# EAGLE schematic Schematic (EAGLE 9.7.0)
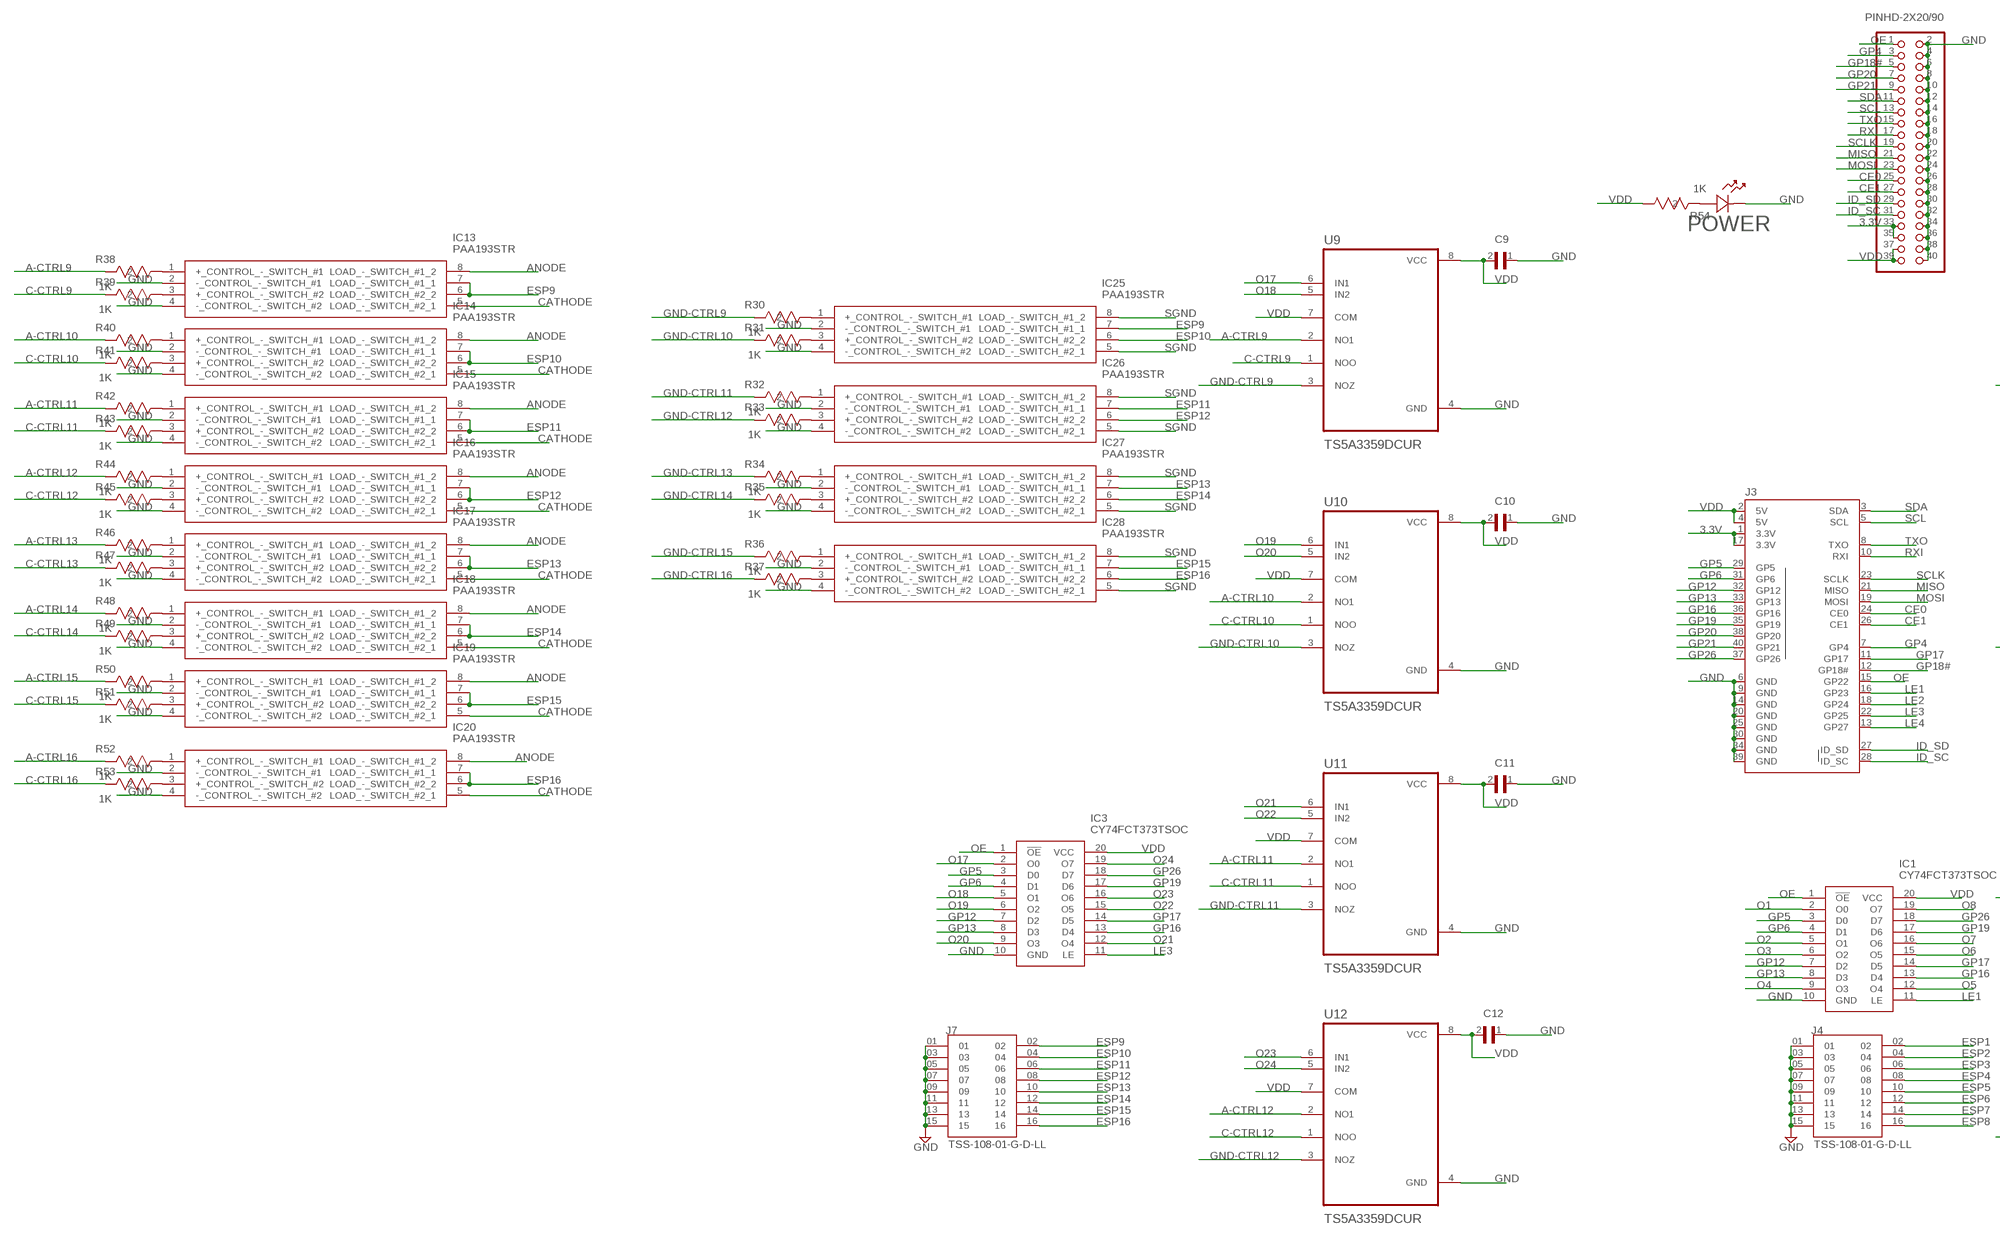
[diagram p0: schematic, sheet 1, part 1 of 3]
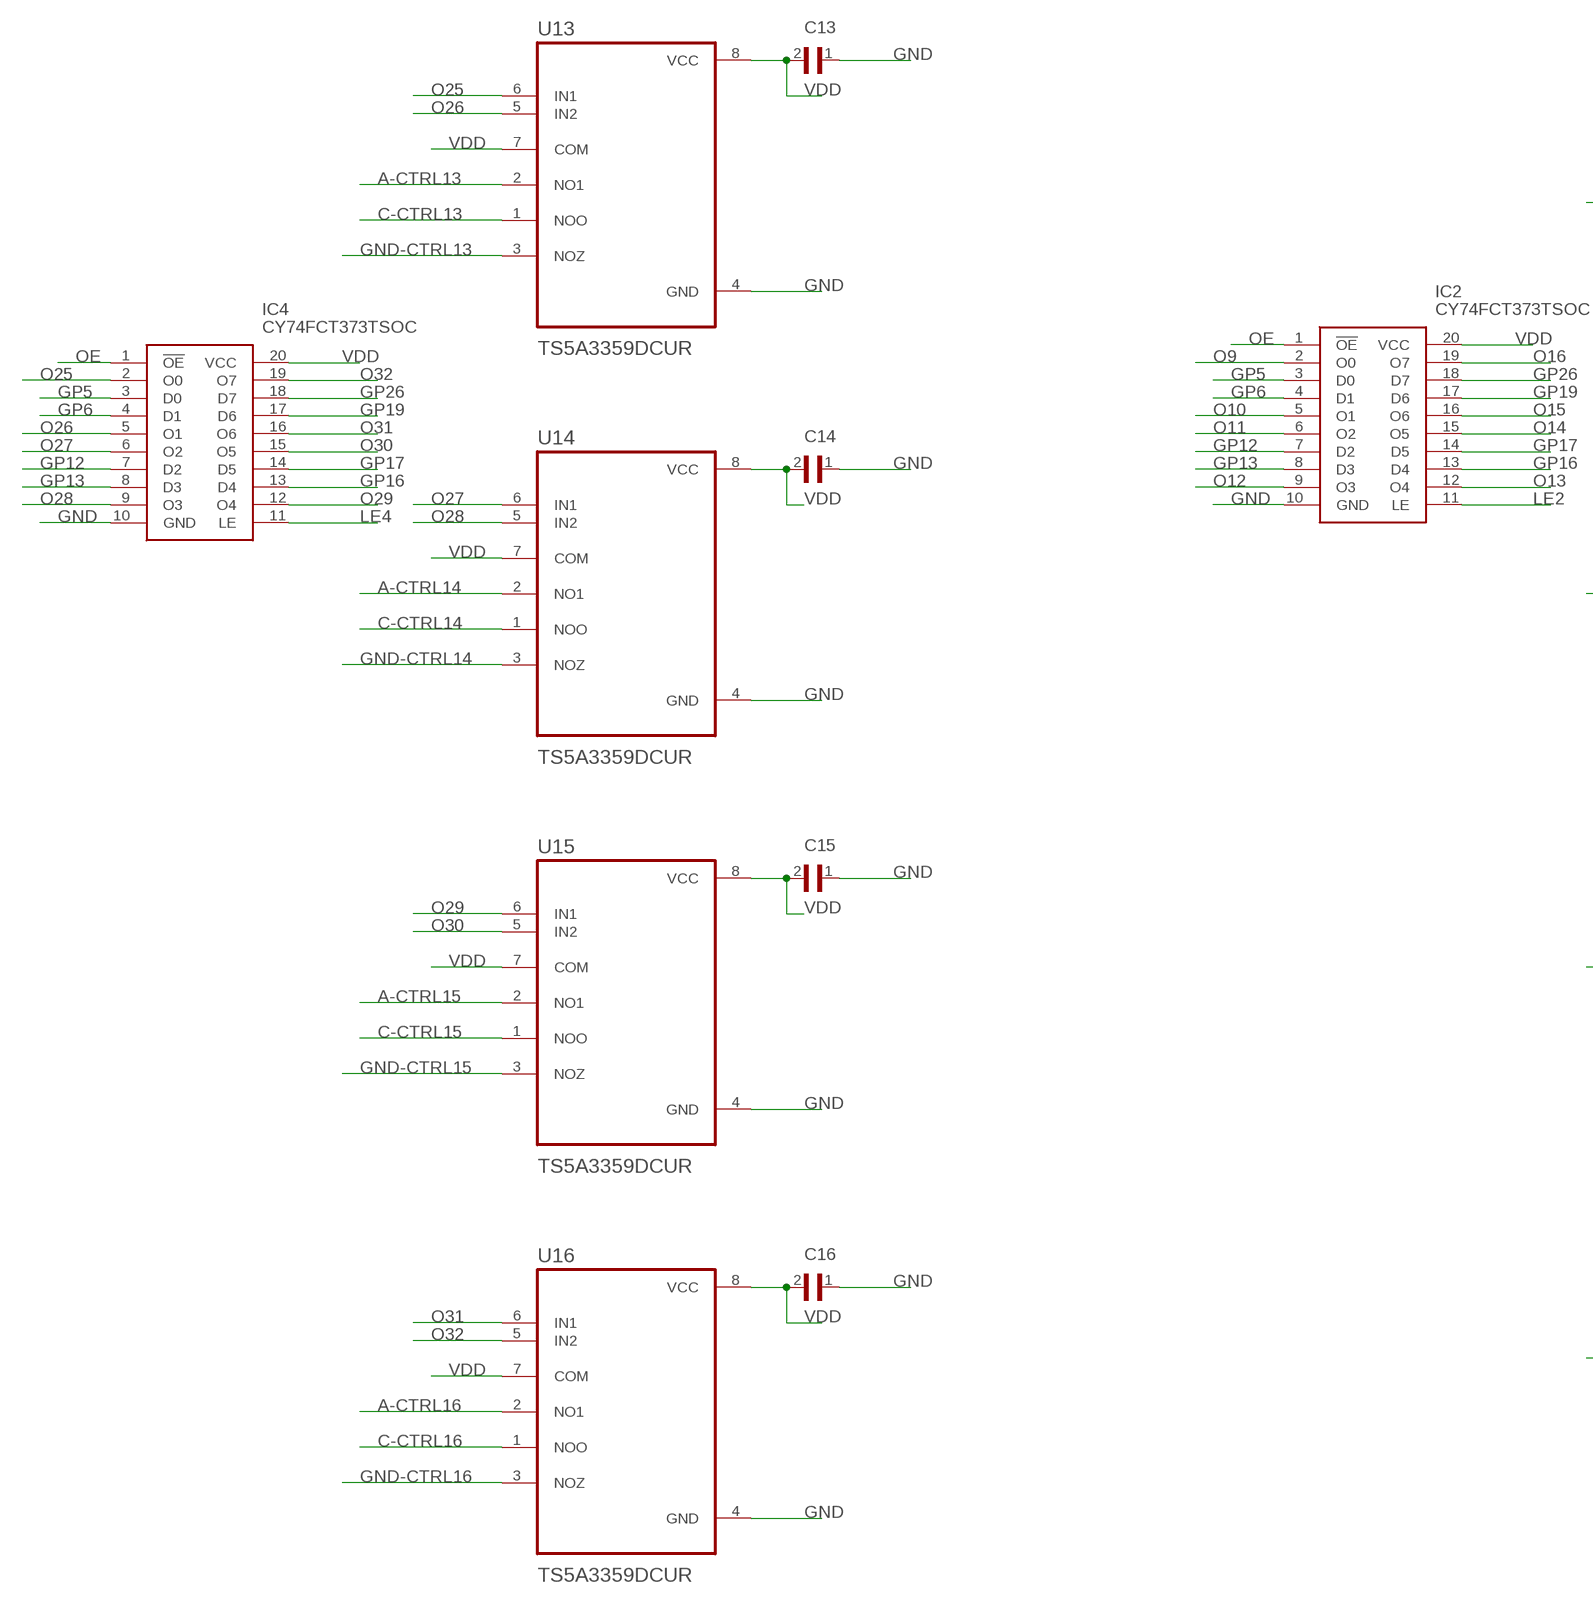
[diagram p1: schematic, sheet 1, part 2 of 3]
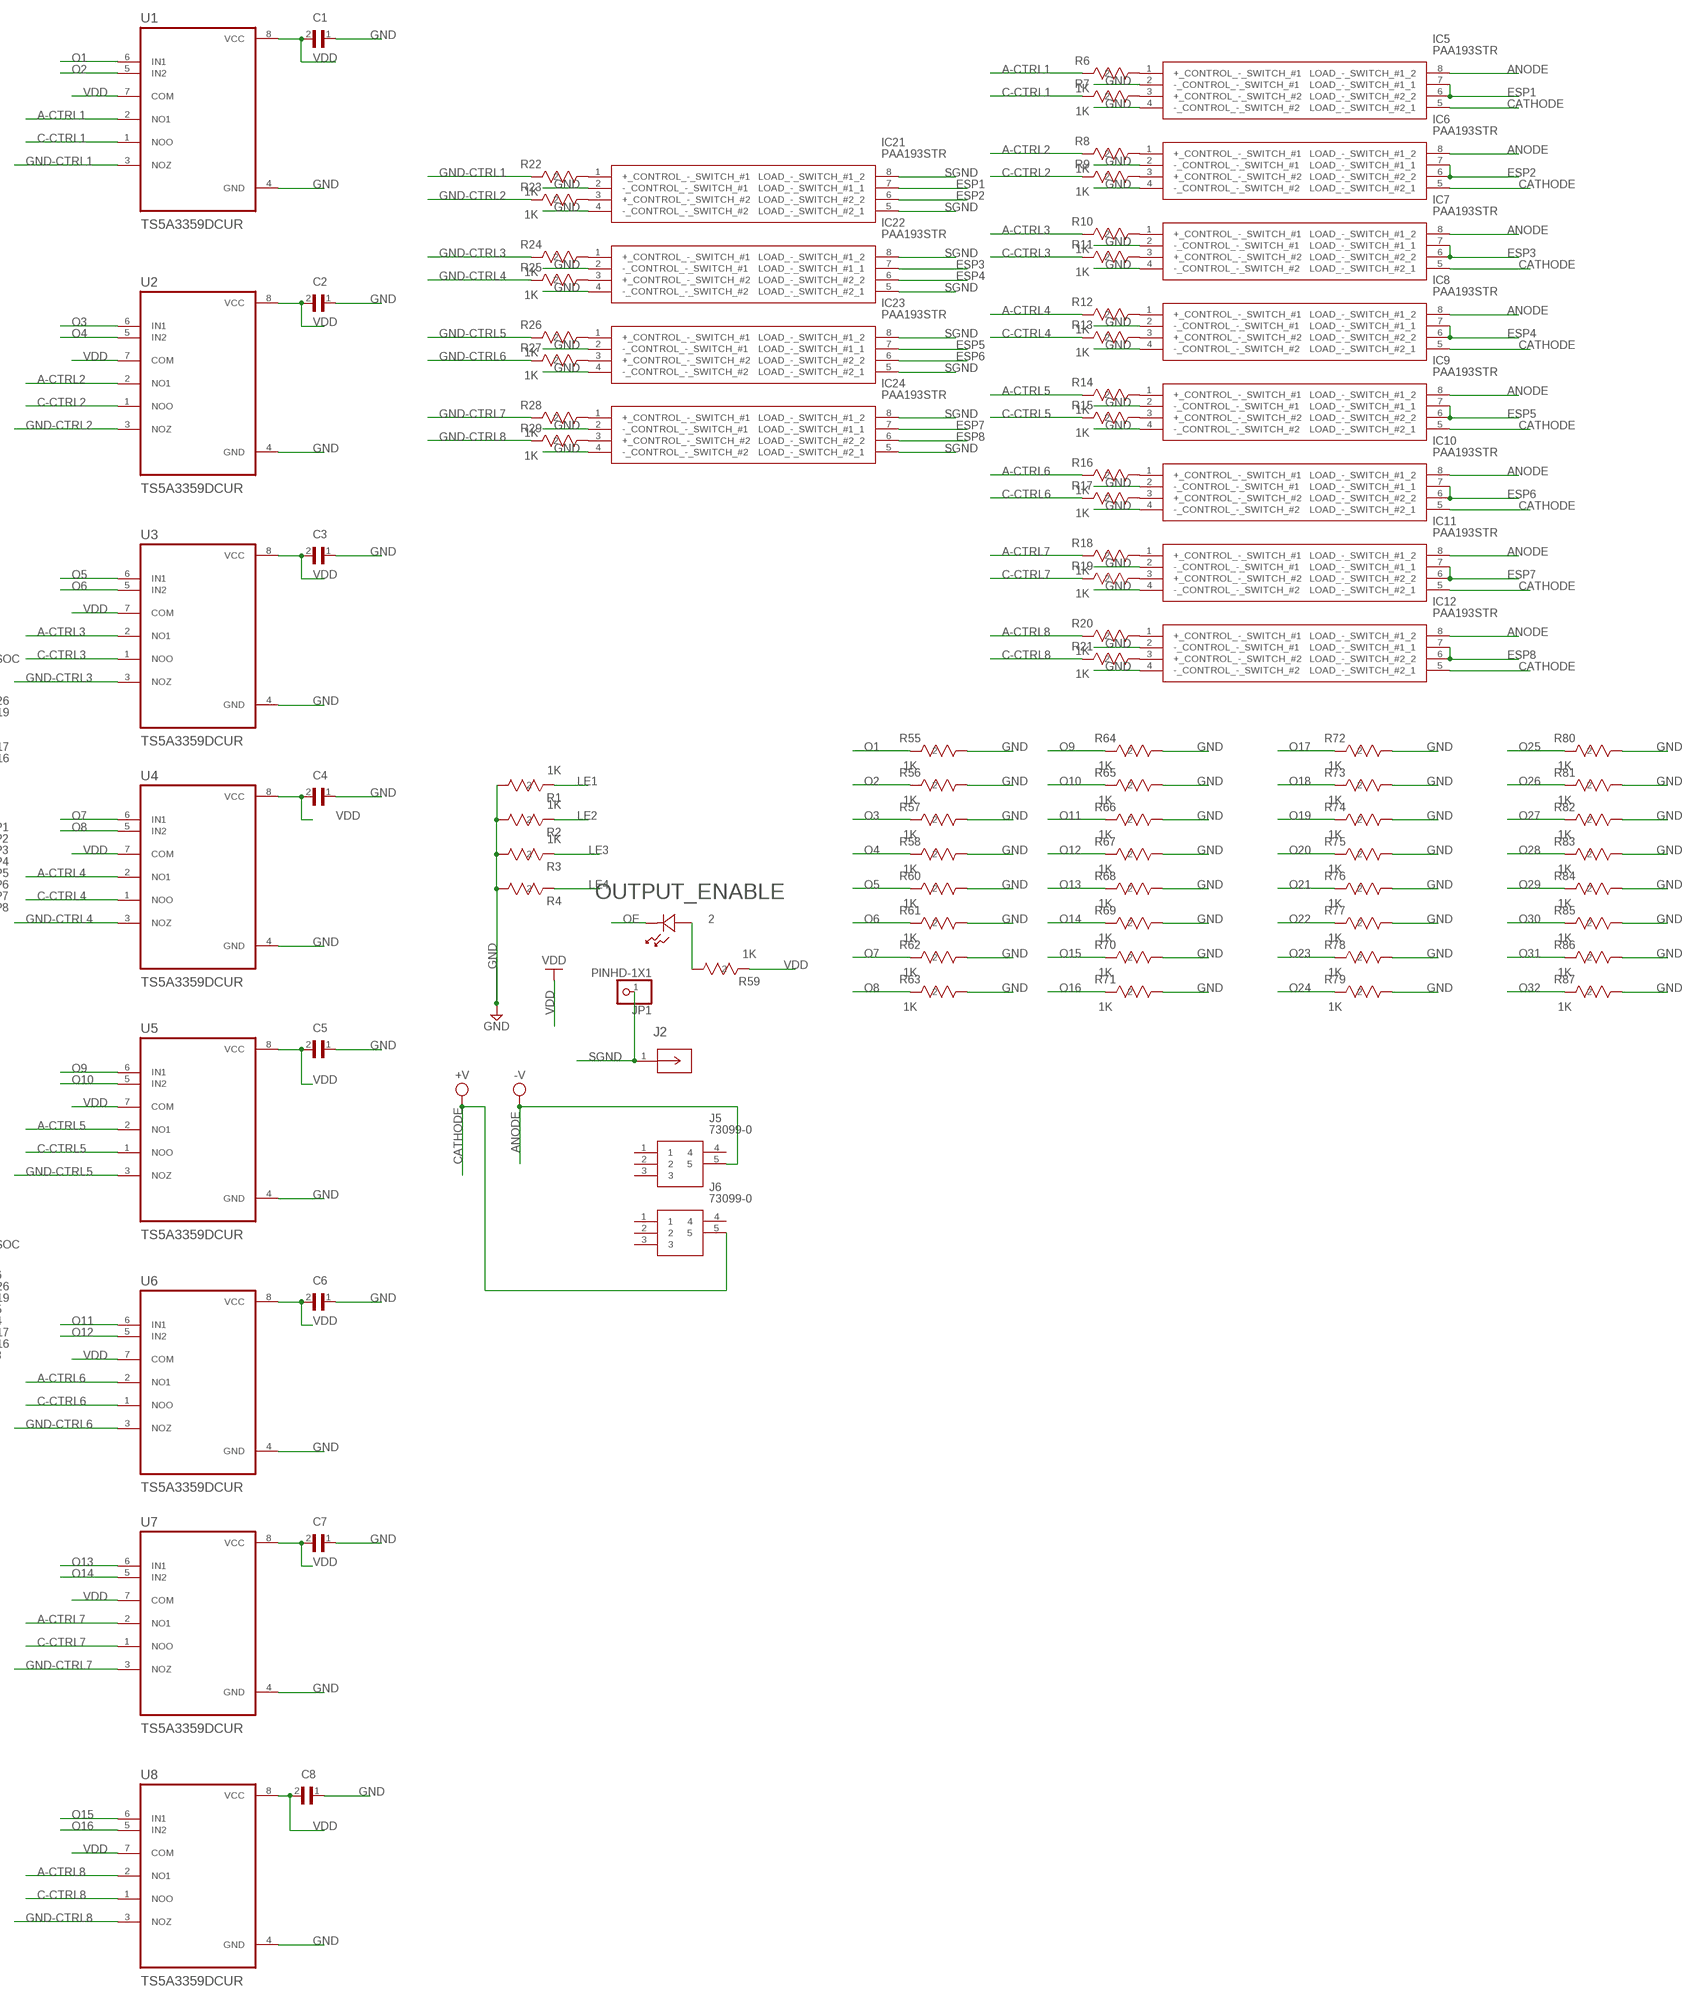
[diagram p2: schematic, sheet 1, part 3 of 3]

## Parts
C1  CL05A104KA5NNNC  [CAPC1005X55N]
C2  CL05A104KA5NNNC  [CAPC1005X55N]
C3  CL05A104KA5NNNC  [CAPC1005X55N]
C4  CL05A104KA5NNNC  [CAPC1005X55N]
C5  CL05A104KA5NNNC  [CAPC1005X55N]
C6  CL05A104KA5NNNC  [CAPC1005X55N]
C7  CL05A104KA5NNNC  [CAPC1005X55N]
C8  CL05A104KA5NNNC  [CAPC1005X55N]
C9  CL05A104KA5NNNC  [CAPC1005X55N]
C10  CL05A104KA5NNNC  [CAPC1005X55N]
C11  CL05A104KA5NNNC  [CAPC1005X55N]
C12  CL05A104KA5NNNC  [CAPC1005X55N]
C13  CL05A104KA5NNNC  [CAPC1005X55N]
C14  CL05A104KA5NNNC  [CAPC1005X55N]
C15  CL05A104KA5NNNC  [CAPC1005X55N]
C16  CL05A104KA5NNNC  [CAPC1005X55N]
IC1  CY74FCT373TSOC  [SOIC127P1030X265-20N]
IC2  CY74FCT373TSOC  [SOIC127P1030X265-20N]
IC3  CY74FCT373TSOC  [SOIC127P1030X265-20N]
IC4  CY74FCT373TSOC  [SOIC127P1030X265-20N]
IC5  PAA193STR  [SOP254P952X457-8N]
IC6  PAA193STR  [SOP254P952X457-8N]
IC7  PAA193STR  [SOP254P952X457-8N]
IC8  PAA193STR  [SOP254P952X457-8N]
IC9  PAA193STR  [SOP254P952X457-8N]
IC10  PAA193STR  [SOP254P952X457-8N]
IC11  PAA193STR  [SOP254P952X457-8N]
IC12  PAA193STR  [SOP254P952X457-8N]
IC13  PAA193STR  [SOP254P952X457-8N]
IC14  PAA193STR  [SOP254P952X457-8N]
IC15  PAA193STR  [SOP254P952X457-8N]
IC16  PAA193STR  [SOP254P952X457-8N]
IC17  PAA193STR  [SOP254P952X457-8N]
IC18  PAA193STR  [SOP254P952X457-8N]
IC19  PAA193STR  [SOP254P952X457-8N]
IC20  PAA193STR  [SOP254P952X457-8N]
IC21  PAA193STR  [SOP254P952X457-8N]
IC22  PAA193STR  [SOP254P952X457-8N]
IC23  PAA193STR  [SOP254P952X457-8N]
IC24  PAA193STR  [SOP254P952X457-8N]
IC25  PAA193STR  [SOP254P952X457-8N]
IC26  PAA193STR  [SOP254P952X457-8N]
IC27  PAA193STR  [SOP254P952X457-8N]
IC28  PAA193STR  [SOP254P952X457-8N]
J2  FCR7350GCONN_FCR7350G_CLF  [CONN_FCR7350G_CLF]
J3  RASPBERRYPI-40-PIN-GPIO_PTH_NO_SHROUD  [2X20]
J4  TSS-108-01-G-D-LL  [SAMTEC_TSS-108-01-G-D-LL]
J5  73099-0  [730990]
J6  73099-0  [730990]
J7  TSS-108-01-G-D-LL  [SAMTEC_TSS-108-01-G-D-LL]
JP1  PINHD-1X1  [1X01]
JP4  PINHD-2X20/90  [2X20/90]
OUTPUT_ENABLE  LTST-C190GKTLED_LTST-C190CKT_LTO  [LED_LTST-C190CKT_LTO]
POWER  LTST-C190GKTLED_LTST-C190CKT_LTO  [LED_LTST-C190CKT_LTO]
R1  1K  RC0402JR-071KLRC0402N_YAG  [RC0402N_YAG]
R2  1K  RC0402JR-071KLRC0402N_YAG  [RC0402N_YAG]
R3  1K  RC0402JR-071KLRC0402N_YAG  [RC0402N_YAG]
R4  RC0402JR-071KLRC0402N_YAG  [RC0402N_YAG]
R6  1K  RC0402JR-071KLRC0402N_YAG  [RC0402N_YAG]
R7  1K  RC0402JR-071KLRC0402N_YAG  [RC0402N_YAG]
R8  1K  RC0402JR-071KLRC0402N_YAG  [RC0402N_YAG]
R9  1K  RC0402JR-071KLRC0402N_YAG  [RC0402N_YAG]
R10  1K  RC0402JR-071KLRC0402N_YAG  [RC0402N_YAG]
R11  1K  RC0402JR-071KLRC0402N_YAG  [RC0402N_YAG]
R12  1K  RC0402JR-071KLRC0402N_YAG  [RC0402N_YAG]
R13  1K  RC0402JR-071KLRC0402N_YAG  [RC0402N_YAG]
R14  1K  RC0402JR-071KLRC0402N_YAG  [RC0402N_YAG]
R15  1K  RC0402JR-071KLRC0402N_YAG  [RC0402N_YAG]
R16  1K  RC0402JR-071KLRC0402N_YAG  [RC0402N_YAG]
R17  1K  RC0402JR-071KLRC0402N_YAG  [RC0402N_YAG]
R18  1K  RC0402JR-071KLRC0402N_YAG  [RC0402N_YAG]
R19  1K  RC0402JR-071KLRC0402N_YAG  [RC0402N_YAG]
R20  1K  RC0402JR-071KLRC0402N_YAG  [RC0402N_YAG]
R21  1K  RC0402JR-071KLRC0402N_YAG  [RC0402N_YAG]
R22  1K  RC0402JR-071KLRC0402N_YAG  [RC0402N_YAG]
R23  1K  RC0402JR-071KLRC0402N_YAG  [RC0402N_YAG]
R24  1K  RC0402JR-071KLRC0402N_YAG  [RC0402N_YAG]
R25  1K  RC0402JR-071KLRC0402N_YAG  [RC0402N_YAG]
R26  1K  RC0402JR-071KLRC0402N_YAG  [RC0402N_YAG]
R27  1K  RC0402JR-071KLRC0402N_YAG  [RC0402N_YAG]
R28  1K  RC0402JR-071KLRC0402N_YAG  [RC0402N_YAG]
R29  1K  RC0402JR-071KLRC0402N_YAG  [RC0402N_YAG]
R30  1K  RC0402JR-071KLRC0402N_YAG  [RC0402N_YAG]
R31  1K  RC0402JR-071KLRC0402N_YAG  [RC0402N_YAG]
R32  1K  RC0402JR-071KLRC0402N_YAG  [RC0402N_YAG]
R33  1K  RC0402JR-071KLRC0402N_YAG  [RC0402N_YAG]
R34  1K  RC0402JR-071KLRC0402N_YAG  [RC0402N_YAG]
R35  1K  RC0402JR-071KLRC0402N_YAG  [RC0402N_YAG]
R36  1K  RC0402JR-071KLRC0402N_YAG  [RC0402N_YAG]
R37  1K  RC0402JR-071KLRC0402N_YAG  [RC0402N_YAG]
R38  1K  RC0402JR-071KLRC0402N_YAG  [RC0402N_YAG]
R39  1K  RC0402JR-071KLRC0402N_YAG  [RC0402N_YAG]
R40  1K  RC0402JR-071KLRC0402N_YAG  [RC0402N_YAG]
R41  1K  RC0402JR-071KLRC0402N_YAG  [RC0402N_YAG]
R42  1K  RC0402JR-071KLRC0402N_YAG  [RC0402N_YAG]
R43  1K  RC0402JR-071KLRC0402N_YAG  [RC0402N_YAG]
R44  1K  RC0402JR-071KLRC0402N_YAG  [RC0402N_YAG]
R45  1K  RC0402JR-071KLRC0402N_YAG  [RC0402N_YAG]
R46  1K  RC0402JR-071KLRC0402N_YAG  [RC0402N_YAG]
R47  1K  RC0402JR-071KLRC0402N_YAG  [RC0402N_YAG]
R48  1K  RC0402JR-071KLRC0402N_YAG  [RC0402N_YAG]
R49  1K  RC0402JR-071KLRC0402N_YAG  [RC0402N_YAG]
R50  1K  RC0402JR-071KLRC0402N_YAG  [RC0402N_YAG]
R51  1K  RC0402JR-071KLRC0402N_YAG  [RC0402N_YAG]
R52  1K  RC0402JR-071KLRC0402N_YAG  [RC0402N_YAG]
R53  1K  RC0402JR-071KLRC0402N_YAG  [RC0402N_YAG]
R54  1K  RC0402JR-071KLRC0402N_YAG  [RC0402N_YAG]
R55  1K  RC0402JR-071KLRC0402N_YAG  [RC0402N_YAG]
R56  1K  RC0402JR-071KLRC0402N_YAG  [RC0402N_YAG]
R57  1K  RC0402JR-071KLRC0402N_YAG  [RC0402N_YAG]
R58  1K  RC0402JR-071KLRC0402N_YAG  [RC0402N_YAG]
R59  1K  RC0402JR-071KLRC0402N_YAG  [RC0402N_YAG]
R60  1K  RC0402JR-071KLRC0402N_YAG  [RC0402N_YAG]
R61  1K  RC0402JR-071KLRC0402N_YAG  [RC0402N_YAG]
R62  1K  RC0402JR-071KLRC0402N_YAG  [RC0402N_YAG]
R63  1K  RC0402JR-071KLRC0402N_YAG  [RC0402N_YAG]
R64  1K  RC0402JR-071KLRC0402N_YAG  [RC0402N_YAG]
R65  1K  RC0402JR-071KLRC0402N_YAG  [RC0402N_YAG]
R66  1K  RC0402JR-071KLRC0402N_YAG  [RC0402N_YAG]
R67  1K  RC0402JR-071KLRC0402N_YAG  [RC0402N_YAG]
R68  1K  RC0402JR-071KLRC0402N_YAG  [RC0402N_YAG]
R69  1K  RC0402JR-071KLRC0402N_YAG  [RC0402N_YAG]
R70  1K  RC0402JR-071KLRC0402N_YAG  [RC0402N_YAG]
R71  1K  RC0402JR-071KLRC0402N_YAG  [RC0402N_YAG]
R72  1K  RC0402JR-071KLRC0402N_YAG  [RC0402N_YAG]
R73  1K  RC0402JR-071KLRC0402N_YAG  [RC0402N_YAG]
R74  1K  RC0402JR-071KLRC0402N_YAG  [RC0402N_YAG]
R75  1K  RC0402JR-071KLRC0402N_YAG  [RC0402N_YAG]
R76  1K  RC0402JR-071KLRC0402N_YAG  [RC0402N_YAG]
R77  1K  RC0402JR-071KLRC0402N_YAG  [RC0402N_YAG]
R78  1K  RC0402JR-071KLRC0402N_YAG  [RC0402N_YAG]
R79  1K  RC0402JR-071KLRC0402N_YAG  [RC0402N_YAG]
R80  1K  RC0402JR-071KLRC0402N_YAG  [RC0402N_YAG]
R81  1K  RC0402JR-071KLRC0402N_YAG  [RC0402N_YAG]
R82  1K  RC0402JR-071KLRC0402N_YAG  [RC0402N_YAG]
R83  1K  RC0402JR-071KLRC0402N_YAG  [RC0402N_YAG]
R84  1K  RC0402JR-071KLRC0402N_YAG  [RC0402N_YAG]
R85  1K  RC0402JR-071KLRC0402N_YAG  [RC0402N_YAG]
R86  1K  RC0402JR-071KLRC0402N_YAG  [RC0402N_YAG]
R87  1K  RC0402JR-071KLRC0402N_YAG  [RC0402N_YAG]
U1  TS5A3359DCUR  [SOP50P310X90-8N]
U2  TS5A3359DCUR  [SOP50P310X90-8N]
U3  TS5A3359DCUR  [SOP50P310X90-8N]
U4  TS5A3359DCUR  [SOP50P310X90-8N]
U5  TS5A3359DCUR  [SOP50P310X90-8N]
U6  TS5A3359DCUR  [SOP50P310X90-8N]
U7  TS5A3359DCUR  [SOP50P310X90-8N]
U8  TS5A3359DCUR  [SOP50P310X90-8N]
U9  TS5A3359DCUR  [SOP50P310X90-8N]
U10  TS5A3359DCUR  [SOP50P310X90-8N]
U11  TS5A3359DCUR  [SOP50P310X90-8N]
U12  TS5A3359DCUR  [SOP50P310X90-8N]
U13  TS5A3359DCUR  [SOP50P310X90-8N]
U14  TS5A3359DCUR  [SOP50P310X90-8N]
U15  TS5A3359DCUR  [SOP50P310X90-8N]
U16  TS5A3359DCUR  [SOP50P310X90-8N]

## Nets
2: OUTPUT_ENABLE.2 R59.1
3.3V: J3.1(3.3V) J3.17(3.3V) JP4.33 JP4.35
A-CTRL1: R6.2 U1.2(NO1)
A-CTRL2: R8.2 U2.2(NO1)
A-CTRL3: R10.2 U3.2(NO1)
A-CTRL4: R12.2 U4.2(NO1)
A-CTRL5: R14.2 U5.2(NO1)
A-CTRL6: R16.2 U6.2(NO1)
A-CTRL7: R18.2 U7.2(NO1)
A-CTRL8: R20.2 U8.2(NO1)
A-CTRL9: R38.2 U9.2(NO1)
A-CTRL10: R40.2 U10.2(NO1)
A-CTRL11: R42.2 U11.2(NO1)
A-CTRL12: R44.2 U12.2(NO1)
A-CTRL13: R46.2 U13.2(NO1)
A-CTRL14: R48.2 U14.2(NO1)
A-CTRL15: R50.2 U15.2(NO1)
A-CTRL16: R52.2 U16.2(NO1)
ANODE: IC5.8(LOAD_-_SWITCH_#1_2) IC6.8(LOAD_-_SWITCH_#1_2) IC7.8(LOAD_-_SWITCH_#1_2) IC8.8(LOAD_-_SWITCH_#1_2) IC9.8(LOAD_-_SWITCH_#1_2) IC10.8(LOAD_-_SWITCH_#1_2) IC11.8(LOAD_-_SWITCH_#1_2) IC12.8(LOAD_-_SWITCH_#1_2) IC13.8(LOAD_-_SWITCH_#1_2) IC14.8(LOAD_-_SWITCH_#1_2) IC15.8(LOAD_-_SWITCH_#1_2) IC16.8(LOAD_-_SWITCH_#1_2) IC17.8(LOAD_-_SWITCH_#1_2) IC18.8(LOAD_-_SWITCH_#1_2) IC19.8(LOAD_-_SWITCH_#1_2) IC20.8(LOAD_-_SWITCH_#1_2) J5.5 ; supply symbol labelled -V
C-CTRL1: R7.2 U1.1(NOO)
C-CTRL2: R9.2 U2.1(NOO)
C-CTRL3: R11.2 U3.1(NOO)
C-CTRL4: R13.2 U4.1(NOO)
C-CTRL5: R15.2 U5.1(NOO)
C-CTRL6: R17.2 U6.1(NOO)
C-CTRL7: R19.2 U7.1(NOO)
C-CTRL8: R21.2 U8.1(NOO)
C-CTRL9: R39.2 U9.1(NOO)
C-CTRL10: R41.2 U10.1(NOO)
C-CTRL11: R43.2 U11.1(NOO)
C-CTRL12: R45.2 U12.1(NOO)
C-CTRL13: R47.2 U13.1(NOO)
C-CTRL14: R49.2 U14.1(NOO)
C-CTRL15: R51.2 U15.1(NOO)
C-CTRL16: R53.2 U16.1(NOO)
CATHODE: IC5.5(LOAD_-_SWITCH_#2_1) IC6.5(LOAD_-_SWITCH_#2_1) IC7.5(LOAD_-_SWITCH_#2_1) IC8.5(LOAD_-_SWITCH_#2_1) IC9.5(LOAD_-_SWITCH_#2_1) IC10.5(LOAD_-_SWITCH_#2_1) IC11.5(LOAD_-_SWITCH_#2_1) IC12.5(LOAD_-_SWITCH_#2_1) IC13.5(LOAD_-_SWITCH_#2_1) IC14.5(LOAD_-_SWITCH_#2_1) IC15.5(LOAD_-_SWITCH_#2_1) IC16.5(LOAD_-_SWITCH_#2_1) IC17.5(LOAD_-_SWITCH_#2_1) IC18.5(LOAD_-_SWITCH_#2_1) IC19.5(LOAD_-_SWITCH_#2_1) IC20.5(LOAD_-_SWITCH_#2_1) J6.5 ; supply symbol labelled +V
CE0: J3.24(CE0) JP4.25
CE1: J3.26(CE1) JP4.27
ESP1: IC5.6(LOAD_-_SWITCH_#2_2) IC5.7(LOAD_-_SWITCH_#1_1) IC21.7(LOAD_-_SWITCH_#1_1) J4.02
ESP2: IC6.6(LOAD_-_SWITCH_#2_2) IC6.7(LOAD_-_SWITCH_#1_1) IC21.6(LOAD_-_SWITCH_#2_2) J4.04
ESP3: IC7.6(LOAD_-_SWITCH_#2_2) IC7.7(LOAD_-_SWITCH_#1_1) IC22.7(LOAD_-_SWITCH_#1_1) J4.06
ESP4: IC8.6(LOAD_-_SWITCH_#2_2) IC8.7(LOAD_-_SWITCH_#1_1) IC22.6(LOAD_-_SWITCH_#2_2) J4.08
ESP5: IC9.6(LOAD_-_SWITCH_#2_2) IC9.7(LOAD_-_SWITCH_#1_1) IC23.7(LOAD_-_SWITCH_#1_1) J4.10
ESP6: IC10.6(LOAD_-_SWITCH_#2_2) IC10.7(LOAD_-_SWITCH_#1_1) IC23.6(LOAD_-_SWITCH_#2_2) J4.12
ESP7: IC11.6(LOAD_-_SWITCH_#2_2) IC11.7(LOAD_-_SWITCH_#1_1) IC24.7(LOAD_-_SWITCH_#1_1) J4.14
ESP8: IC12.6(LOAD_-_SWITCH_#2_2) IC12.7(LOAD_-_SWITCH_#1_1) IC24.6(LOAD_-_SWITCH_#2_2) J4.16
ESP9: IC13.6(LOAD_-_SWITCH_#2_2) IC13.7(LOAD_-_SWITCH_#1_1) IC25.7(LOAD_-_SWITCH_#1_1) J7.02
ESP10: IC14.6(LOAD_-_SWITCH_#2_2) IC14.7(LOAD_-_SWITCH_#1_1) IC25.6(LOAD_-_SWITCH_#2_2) J7.04
ESP11: IC15.6(LOAD_-_SWITCH_#2_2) IC15.7(LOAD_-_SWITCH_#1_1) IC26.7(LOAD_-_SWITCH_#1_1) J7.06
ESP12: IC16.6(LOAD_-_SWITCH_#2_2) IC16.7(LOAD_-_SWITCH_#1_1) IC26.6(LOAD_-_SWITCH_#2_2) J7.08
ESP13: IC17.6(LOAD_-_SWITCH_#2_2) IC17.7(LOAD_-_SWITCH_#1_1) IC27.7(LOAD_-_SWITCH_#1_1) J7.10
ESP14: IC18.6(LOAD_-_SWITCH_#2_2) IC18.7(LOAD_-_SWITCH_#1_1) IC27.6(LOAD_-_SWITCH_#2_2) J7.12
ESP15: IC19.6(LOAD_-_SWITCH_#2_2) IC19.7(LOAD_-_SWITCH_#1_1) IC28.7(LOAD_-_SWITCH_#1_1) J7.14
ESP16: IC20.6(LOAD_-_SWITCH_#2_2) IC20.7(LOAD_-_SWITCH_#1_1) IC28.6(LOAD_-_SWITCH_#2_2) J7.16
GND: C1.1 C2.1 C3.1 C4.1 C5.1 C6.1 C7.1 C8.1 C9.1 C10.1 C11.1 C12.1 C13.1 C14.1 C15.1 C16.1 IC1.10(GND) IC2.10(GND) IC3.10(GND) IC4.10(GND) IC5.2(-_CONTROL_-_SWITCH_#1) IC5.4(-_CONTROL_-_SWITCH_#2) IC6.2(-_CONTROL_-_SWITCH_#1) IC6.4(-_CONTROL_-_SWITCH_#2) IC7.2(-_CONTROL_-_SWITCH_#1) IC7.4(-_CONTROL_-_SWITCH_#2) IC8.2(-_CONTROL_-_SWITCH_#1) IC8.4(-_CONTROL_-_SWITCH_#2) IC9.2(-_CONTROL_-_SWITCH_#1) IC9.4(-_CONTROL_-_SWITCH_#2) IC10.2(-_CONTROL_-_SWITCH_#1) IC10.4(-_CONTROL_-_SWITCH_#2) IC11.2(-_CONTROL_-_SWITCH_#1) IC11.4(-_CONTROL_-_SWITCH_#2) IC12.2(-_CONTROL_-_SWITCH_#1) IC12.4(-_CONTROL_-_SWITCH_#2) IC13.2(-_CONTROL_-_SWITCH_#1) IC13.4(-_CONTROL_-_SWITCH_#2) IC14.2(-_CONTROL_-_SWITCH_#1) IC14.4(-_CONTROL_-_SWITCH_#2) IC15.2(-_CONTROL_-_SWITCH_#1) IC15.4(-_CONTROL_-_SWITCH_#2) IC16.2(-_CONTROL_-_SWITCH_#1) IC16.4(-_CONTROL_-_SWITCH_#2) IC17.2(-_CONTROL_-_SWITCH_#1) IC17.4(-_CONTROL_-_SWITCH_#2) IC18.2(-_CONTROL_-_SWITCH_#1) IC18.4(-_CONTROL_-_SWITCH_#2) IC19.2(-_CONTROL_-_SWITCH_#1) IC19.4(-_CONTROL_-_SWITCH_#2) IC20.2(-_CONTROL_-_SWITCH_#1) IC20.4(-_CONTROL_-_SWITCH_#2) IC21.2(-_CONTROL_-_SWITCH_#1) IC21.4(-_CONTROL_-_SWITCH_#2) IC22.2(-_CONTROL_-_SWITCH_#1) IC22.4(-_CONTROL_-_SWITCH_#2) IC23.2(-_CONTROL_-_SWITCH_#1) IC23.4(-_CONTROL_-_SWITCH_#2) IC24.2(-_CONTROL_-_SWITCH_#1) IC24.4(-_CONTROL_-_SWITCH_#2) IC25.2(-_CONTROL_-_SWITCH_#1) IC25.4(-_CONTROL_-_SWITCH_#2) IC26.2(-_CONTROL_-_SWITCH_#1) IC26.4(-_CONTROL_-_SWITCH_#2) IC27.2(-_CONTROL_-_SWITCH_#1) IC27.4(-_CONTROL_-_SWITCH_#2) IC28.2(-_CONTROL_-_SWITCH_#1) IC28.4(-_CONTROL_-_SWITCH_#2) J3.6(GND) J3.9(GND) J3.14(GND) J3.20(GND) J3.25(GND) J3.30(GND) J3.34(GND) J3.39(GND) J4.01 J4.03 J4.05 J4.07 J4.09 J4.11 J4.13 J4.15 J7.01 J7.03 J7.05 J7.07 J7.09 J7.11 J7.13 J7.15 JP4.2 JP4.4 JP4.6 JP4.8 JP4.10 JP4.12 JP4.14 JP4.16 JP4.18 JP4.20 JP4.22 JP4.24 JP4.26 JP4.28 JP4.30 JP4.32 JP4.34 JP4.36 JP4.38 JP4.40 POWER.1 R1.1 R2.1 R3.1 R4.1 R55.1 R56.1 R57.1 R58.1 R60.1 R61.1 R62.1 R63.1 R64.1 R65.1 R66.1 R67.1 R68.1 R69.1 R70.1 R71.1 R72.1 R73.1 R74.1 R75.1 R76.1 R77.1 R78.1 R79.1 R80.1 R81.1 R82.1 R83.1 R84.1 R85.1 R86.1 R87.1 U1.4(GND) U2.4(GND) U3.4(GND) U4.4(GND) U5.4(GND) U6.4(GND) U7.4(GND) U8.4(GND) U9.4(GND) U10.4(GND) U11.4(GND) U12.4(GND) U13.4(GND) U14.4(GND) U15.4(GND) U16.4(GND)
GND-CTRL1: R22.2 U1.3(NOZ)
GND-CTRL2: R23.2 U2.3(NOZ)
GND-CTRL3: R24.2 U3.3(NOZ)
GND-CTRL4: R25.2 U4.3(NOZ)
GND-CTRL5: R26.2 U5.3(NOZ)
GND-CTRL6: R27.2 U6.3(NOZ)
GND-CTRL7: R28.2 U7.3(NOZ)
GND-CTRL8: R29.2 U8.3(NOZ)
GND-CTRL9: R30.2 U9.3(NOZ)
GND-CTRL10: R31.2 U10.3(NOZ)
GND-CTRL11: R32.2 U11.3(NOZ)
GND-CTRL12: R33.2 U12.3(NOZ)
GND-CTRL13: R34.2 U13.3(NOZ)
GND-CTRL14: R35.2 U14.3(NOZ)
GND-CTRL15: R36.2 U15.3(NOZ)
GND-CTRL16: R37.2 U16.3(NOZ)
GP4: J3.7(GP4) JP4.3
GP5: IC1.3(D0) IC2.3(D0) IC3.3(D0) IC4.3(D0) J3.29(GP5)
GP6: IC1.4(D1) IC2.4(D1) IC3.4(D1) IC4.4(D1) J3.31(GP6)
GP12: IC1.7(D2) IC2.7(D2) IC3.7(D2) IC4.7(D2) J3.32(GP12)
GP13: IC1.8(D3) IC2.8(D3) IC3.8(D3) IC4.8(D3) J3.33(GP13)
GP16: IC1.13(D4) IC2.13(D4) IC3.13(D4) IC4.13(D4) J3.36(GP16)
GP17: IC1.14(D5) IC2.14(D5) IC3.14(D5) IC4.14(D5) J3.11(GP17)
GP18#: J3.12(GP18#) JP4.5
GP19: IC1.17(D6) IC2.17(D6) IC3.17(D6) IC4.17(D6) J3.35(GP19)
GP20: J3.38(GP20) JP4.7
GP21: J3.40(GP21) JP4.9
GP26: IC1.18(D7) IC2.18(D7) IC3.18(D7) IC4.18(D7) J3.37(GP26)
ID_SC: J3.28(ID_SC) JP4.31
ID_SD: J3.27(ID_SD) JP4.29
LE1: IC1.11(LE) J3.16(GP23) R1.2
LE2: IC2.11(LE) J3.18(GP24) R2.2
LE3: IC3.11(LE) J3.22(GP25) R3.2
LE4: IC4.11(LE) J3.13(GP27) R4.2
MISO: J3.21(MISO) JP4.21
MOSI: J3.19(MOSI) JP4.23
N$3: POWER.2 R54.2
N$4: IC5.1(+_CONTROL_-_SWITCH_#1) R6.1
N$5: IC5.3(+_CONTROL_-_SWITCH_#2) R7.1
N$6: IC6.1(+_CONTROL_-_SWITCH_#1) R8.1
N$7: IC6.3(+_CONTROL_-_SWITCH_#2) R9.1
N$8: IC7.1(+_CONTROL_-_SWITCH_#1) R10.1
N$9: IC7.3(+_CONTROL_-_SWITCH_#2) R11.1
N$10: IC8.1(+_CONTROL_-_SWITCH_#1) R12.1
N$11: IC8.3(+_CONTROL_-_SWITCH_#2) R13.1
N$12: IC9.1(+_CONTROL_-_SWITCH_#1) R14.1
N$13: IC9.3(+_CONTROL_-_SWITCH_#2) R15.1
N$14: IC10.1(+_CONTROL_-_SWITCH_#1) R16.1
N$15: IC10.3(+_CONTROL_-_SWITCH_#2) R17.1
N$16: IC11.1(+_CONTROL_-_SWITCH_#1) R18.1
N$17: IC11.3(+_CONTROL_-_SWITCH_#2) R19.1
N$18: IC12.1(+_CONTROL_-_SWITCH_#1) R20.1
N$19: IC12.3(+_CONTROL_-_SWITCH_#2) R21.1
N$20: IC21.1(+_CONTROL_-_SWITCH_#1) R22.1
N$21: IC21.3(+_CONTROL_-_SWITCH_#2) R23.1
N$22: IC22.1(+_CONTROL_-_SWITCH_#1) R24.1
N$23: IC22.3(+_CONTROL_-_SWITCH_#2) R25.1
N$24: IC23.1(+_CONTROL_-_SWITCH_#1) R26.1
N$25: IC23.3(+_CONTROL_-_SWITCH_#2) R27.1
N$26: IC24.1(+_CONTROL_-_SWITCH_#1) R28.1
N$27: IC24.3(+_CONTROL_-_SWITCH_#2) R29.1
N$28: IC25.1(+_CONTROL_-_SWITCH_#1) R30.1
N$29: IC25.3(+_CONTROL_-_SWITCH_#2) R31.1
N$30: IC26.1(+_CONTROL_-_SWITCH_#1) R32.1
N$31: IC26.3(+_CONTROL_-_SWITCH_#2) R33.1
N$32: IC27.1(+_CONTROL_-_SWITCH_#1) R34.1
N$33: IC27.3(+_CONTROL_-_SWITCH_#2) R35.1
N$34: IC28.1(+_CONTROL_-_SWITCH_#1) R36.1
N$35: IC28.3(+_CONTROL_-_SWITCH_#2) R37.1
N$36: IC13.1(+_CONTROL_-_SWITCH_#1) R38.1
N$37: IC13.3(+_CONTROL_-_SWITCH_#2) R39.1
N$38: IC14.1(+_CONTROL_-_SWITCH_#1) R40.1
N$39: IC14.3(+_CONTROL_-_SWITCH_#2) R41.1
N$40: IC15.1(+_CONTROL_-_SWITCH_#1) R42.1
N$41: IC15.3(+_CONTROL_-_SWITCH_#2) R43.1
N$42: IC16.1(+_CONTROL_-_SWITCH_#1) R44.1
N$43: IC16.3(+_CONTROL_-_SWITCH_#2) R45.1
N$44: IC17.1(+_CONTROL_-_SWITCH_#1) R46.1
N$45: IC17.3(+_CONTROL_-_SWITCH_#2) R47.1
N$46: IC18.1(+_CONTROL_-_SWITCH_#1) R48.1
N$47: IC18.3(+_CONTROL_-_SWITCH_#2) R49.1
N$48: IC19.1(+_CONTROL_-_SWITCH_#1) R50.1
N$49: IC19.3(+_CONTROL_-_SWITCH_#2) R51.1
N$50: IC20.1(+_CONTROL_-_SWITCH_#1) R52.1
N$51: IC20.3(+_CONTROL_-_SWITCH_#2) R53.1
O1: IC1.2(O0) R55.2 U1.6(IN1)
O2: IC1.5(O1) R56.2 U1.5(IN2)
O3: IC1.6(O2) R57.2 U2.6(IN1)
O4: IC1.9(O3) R58.2 U2.5(IN2)
O5: IC1.12(O4) R60.2 U3.6(IN1)
O6: IC1.15(O5) R61.2 U3.5(IN2)
O7: IC1.16(O6) R62.2 U4.6(IN1)
O8: IC1.19(O7) R63.2 U4.5(IN2)
O9: IC2.2(O0) R64.2 U5.6(IN1)
O10: IC2.5(O1) R65.2 U5.5(IN2)
O11: IC2.6(O2) R66.2 U6.6(IN1)
O12: IC2.9(O3) R67.2 U6.5(IN2)
O13: IC2.12(O4) R68.2 U7.6(IN1)
O14: IC2.15(O5) R69.2 U7.5(IN2)
O15: IC2.16(O6) R70.2 U8.6(IN1)
O16: IC2.19(O7) R71.2 U8.5(IN2)
O17: IC3.2(O0) R72.2 U9.6(IN1)
O18: IC3.5(O1) R73.2 U9.5(IN2)
O19: IC3.6(O2) R74.2 U10.6(IN1)
O20: IC3.9(O3) R75.2 U10.5(IN2)
O21: IC3.12(O4) R76.2 U11.6(IN1)
O22: IC3.15(O5) R77.2 U11.5(IN2)
O23: IC3.16(O6) R78.2 U12.6(IN1)
O24: IC3.19(O7) R79.2 U12.5(IN2)
O25: IC4.2(O0) R80.2 U13.6(IN1)
O26: IC4.5(O1) R81.2 U13.5(IN2)
O27: IC4.6(O2) R82.2 U14.6(IN1)
O28: IC4.9(O3) R83.2 U14.5(IN2)
O29: IC4.12(O4) R84.2 U15.6(IN1)
O30: IC4.15(O5) R85.2 U15.5(IN2)
O31: IC4.16(O6) R86.2 U16.6(IN1)
O32: IC4.19(O7) R87.2 U16.5(IN2)
OE: IC1.1(!OE) IC2.1(!OE) IC3.1(!OE) IC4.1(!OE) J3.15(GP22) JP4.1 OUTPUT_ENABLE.1
RXI: J3.10(RXI) JP4.17
SCL: J3.5(SCL) JP4.13
SCLK: J3.23(SCLK) JP4.19
SDA: J3.3(SDA) JP4.11
SGND: IC21.5(LOAD_-_SWITCH_#2_1) IC21.8(LOAD_-_SWITCH_#1_2) IC22.5(LOAD_-_SWITCH_#2_1) IC22.8(LOAD_-_SWITCH_#1_2) IC23.5(LOAD_-_SWITCH_#2_1) IC23.8(LOAD_-_SWITCH_#1_2) IC24.5(LOAD_-_SWITCH_#2_1) IC24.8(LOAD_-_SWITCH_#1_2) IC25.5(LOAD_-_SWITCH_#2_1) IC25.8(LOAD_-_SWITCH_#1_2) IC26.5(LOAD_-_SWITCH_#2_1) IC26.8(LOAD_-_SWITCH_#1_2) IC27.5(LOAD_-_SWITCH_#2_1) IC27.8(LOAD_-_SWITCH_#1_2) IC28.5(LOAD_-_SWITCH_#2_1) IC28.8(LOAD_-_SWITCH_#1_2) J2.1 JP1.1
TXO: J3.8(TXO) JP4.15
VDD: C1.2 C2.2 C3.2 C4.2 C5.2 C6.2 C7.2 C8.2 C9.2 C10.2 C11.2 C12.2 C13.2 C14.2 C15.2 C16.2 IC1.20(VCC) IC2.20(VCC) IC3.20(VCC) IC4.20(VCC) J3.2(5V) J3.4(5V) JP4.37 JP4.39 R54.1 R59.2 U1.7(COM) U1.8(VCC) U2.7(COM) U2.8(VCC) U3.7(COM) U3.8(VCC) U4.7(COM) U4.8(VCC) U5.7(COM) U5.8(VCC) U6.7(COM) U6.8(VCC) U7.7(COM) U7.8(VCC) U8.7(COM) U8.8(VCC) U9.7(COM) U9.8(VCC) U10.7(COM) U10.8(VCC) U11.7(COM) U11.8(VCC) U12.7(COM) U12.8(VCC) U13.7(COM) U13.8(VCC) U14.7(COM) U14.8(VCC) U15.7(COM) U15.8(VCC) U16.7(COM) U16.8(VCC)
Unconnected: J5.1 J5.2 J5.3 J5.4 J6.1 J6.2 J6.3 J6.4

## Library data of the parts
C1-C16 = CL05A104KA5NNNC:CL05A104KA5NNNC: Capacitor [Samsung] CL05A104KA5NNNC Capacitor Check availability <https://pricing.snapeda.com/parts/CL05A104KA5NNNC/Samsung%20Electro-Mechanics/view-part?ref=eda>; AVAILABILITY: In Stock; CHECK_PRICES: https://www.snapeda.com/parts/CL05A104KA5NNNC/Samsung+Electro-Mechanics/view-part/?ref=eda; DESCRIPTION: 0.1 µF ±10% 25V Ceramic Capacitor X5R 0402 (1005 Metric); MF: Samsung Electro-Mechanics; MP: CL05A104KA5NNNC; PACKAGE: 0402 Samsung; PRICE: None; PURCHASE-URL: https://pricing.snapeda.com/search?q=CL05A104KA5NNNC&ref=eda; SNAPEDA_LINK: https://www.snapeda.com/parts/CL05A104KA5NNNC/Samsung+Electro-Mechanics/view-part/?ref=snap
IC1-IC4 = CY74FCT373SOC-Local:CY74FCT373TSOC: Octal Transparent D-Type Latches with 3-State Outputs Source: Datasheet <http://www.ti.com/lit/gpn/CY74FCT373T>; DESCRIPTION: Octal Transparent D-Type Latches with 3-State Outputs; HEIGHT: 2.65mm; MANUFACTURER_NAME: Texas Instruments; MANUFACTURER_PART_NUMBER: CY74FCT373TSOC
IC5-IC28 = PAA193STR-Local:PAA193STR: Solid State Relay 50mA 1.4V DC-IN 0.1A 600V AC/DC-OUT 8-Pin PDIP SMD T/R Source: Datasheet <https://componentsearchengine.com/Datasheets/1/PAA193STR.pdf>; DESCRIPTION: Solid State Relay 50mA 1.4V DC-IN 0.1A 600V AC/DC-OUT 8-Pin PDIP SMD T/R; HEIGHT: 4.572mm; MANUFACTURER_NAME: LITTELFUSE; MANUFACTURER_PART_NUMBER: PAA193STR; MOUSER_PART_NUMBER: 849-PAA193STR; MOUSER_PRICE-STOCK: https://www.mouser.com/Search/Refine.aspx?Keyword=849-PAA193STR
J2 = FCR7350G:FCR7350G; COPYRIGHT: Copyright (C) 2024 Ultra Librarian. All rights reserved.; MANUFACTURER_PART_NUMBER: FCR7350G; MFR_NAME: Cliff
J3 = SparkFun-Connectors-Local:RASPBERRYPI-40-PIN-GPIO: Raspberry Pi GPIO Header 2x20 pin connector, as found on B, B+, A+ models. Both shrouded PTH and SMT versions available. SparkFun Products: GPIO Shrouded Header <https://www.sparkfun.com/products/13054>- PTH SparkFun Pi Wedge (Preassembled) <https://www.sparkfun.com/products/13717>; SPICEPREFIX: X
J4 J7 = TSS-108-01-G-D-LL-Local:TSS-108-01-G-D-LL: Check availability <https://pricing.snapeda.com/parts/TSS-108-01-G-D-LL/Samtec/view-part?ref=eda>
J5 J6 = 73099-0-Local:73099-0: Test Plugs & Test Jacks RT ANG 4mm MOUNTING SAFETY JACK PCB BLK Source: Datasheet <http://assets.edgenet.com/bc247afe-c6d3-4b5e-af4b-80e7f9cda64b>; DESCRIPTION: Test Plugs & Test Jacks RT ANG 4mm MOUNTING SAFETY JACK PCB BLK; HEIGHT: 11.5mm; MANUFACTURER_NAME: Pomona Electronics; MANUFACTURER_PART_NUMBER: 73099-0; MOUSER_PART_NUMBER: 565-73099-0; MOUSER_PRICE-STOCK: https://www.mouser.co.uk/ProductDetail/Pomona-Electronics/73099-0?qs=B6kkDfuK7%2FDgwxUVoyhL3Q%3D%3D
JP1 = Connector:PINHD-1X1: PIN HEADER; CATEGORY: Headers; DESCRIPTION: Header, Straight, 1 Position; MANUFACTURER: Generic; MPN: Generic; OPERATING_TEMPERATURE: Generic; PART_STATUS: Active; PITCH: 0.100" (2.54mm); ROHS_COMPLIANCE: Generic; SERIES: Generic; SUB-CATEGORY: Headers, Male Pins; TYPE: Board to Board or Cable, Unshrouded, Through Hole, Straight
JP4 = Connector:PINHD-2X20: PIN HEADER; CATEGORY: Headers; DESCRIPTION: Header, Right Angle, 2x20 Position; MANUFACTURER: Generic; MPN: Generic; OPERATING_TEMPERATURE: Generic; PART_STATUS: Active; PITCH: 0.100" (2.54mm); ROHS_COMPLIANCE: Generic; SERIES: Generic; SUB-CATEGORY: Headers, Male Pins; TYPE: Board to Board or Cable, Unshrouded, Through Hole, Right Angle
OUTPUT_ENABLE POWER = 2024-01-29_23-07-25_Library:LTST-C190GKT; COPYRIGHT: Copyright (C) 2024 Ultra Librarian. All rights reserved.; MANUFACTURER_PART_NUMBER: LTST-C190GKT; MFR_NAME: LITE-ON
R1-R4 R6-R87 = RC0402N_YAG_Local:RC0402JR-071KL; COPYRIGHT: Copyright (C) 2023 Ultra Librarian. All rights reserved.; MANUFACTURER_PART_NUMBER: RC0402JR-071KL; MFR_NAME: Yageo
U1-U16 = Library:TS5A3359DCUR: Check availability <https://pricing.snapeda.com/parts/TS5A3359DCUR/Texas%20Instruments/view-part?ref=eda>